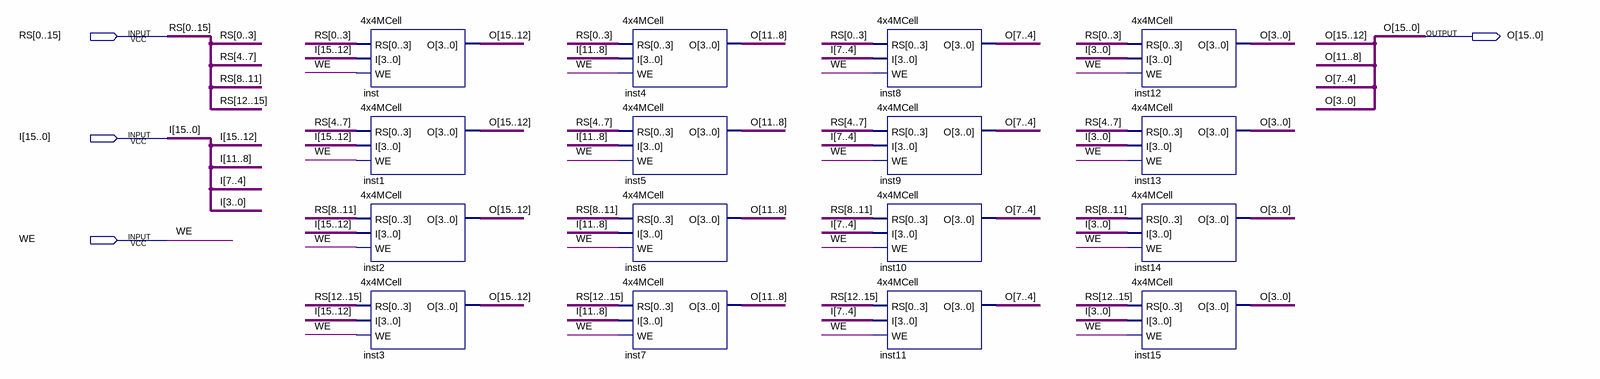
[diagram p0: schematic sheet]
// Quartus schematic 16x16MCell.bdf as structural Verilog: 16 symbols, 4 pins
module \16x16MCell  (
  input  [0:15] RS,
  input  [15:0] I,
  input  WE,
  output [15:0] O
);

  \4x4MCell  inst (.RS(RS[0:3]), .I(I[15:12]), .WE(WE), .O(O[15:12]));
  \4x4MCell  inst1 (.RS(RS[4:7]), .I(I[15:12]), .WE(WE), .O(O[15:12]));
  \4x4MCell  inst2 (.RS(RS[8:11]), .I(I[15:12]), .WE(WE), .O(O[15:12]));
  \4x4MCell  inst3 (.RS(RS[12:15]), .I(I[15:12]), .WE(WE), .O(O[15:12]));
  \4x4MCell  inst4 (.RS(RS[0:3]), .I(I[11:8]), .WE(WE), .O(O[11:8]));
  \4x4MCell  inst5 (.RS(RS[4:7]), .I(I[11:8]), .WE(WE), .O(O[11:8]));
  \4x4MCell  inst6 (.RS(RS[8:11]), .I(I[11:8]), .WE(WE), .O(O[11:8]));
  \4x4MCell  inst7 (.RS(RS[12:15]), .I(I[11:8]), .WE(WE), .O(O[11:8]));
  \4x4MCell  inst8 (.RS(RS[0:3]), .I(I[7:4]), .WE(WE), .O(O[7:4]));
  \4x4MCell  inst9 (.RS(RS[4:7]), .I(I[7:4]), .WE(WE), .O(O[7:4]));
  \4x4MCell  inst10 (.RS(RS[8:11]), .I(I[7:4]), .WE(WE), .O(O[7:4]));
  \4x4MCell  inst11 (.RS(RS[12:15]), .I(I[7:4]), .WE(WE), .O(O[7:4]));
  \4x4MCell  inst12 (.RS(RS[0:3]), .I(I[3:0]), .WE(WE), .O(O[3:0]));
  \4x4MCell  inst13 (.RS(RS[4:7]), .I(I[3:0]), .WE(WE), .O(O[3:0]));
  \4x4MCell  inst14 (.RS(RS[8:11]), .I(I[3:0]), .WE(WE), .O(O[3:0]));
  \4x4MCell  inst15 (.RS(RS[12:15]), .I(I[3:0]), .WE(WE), .O(O[3:0]));
endmodule
